# EAGLE schematic canSlaveV04 (EAGLE 6.5.0)

## Sheet 1 of 5
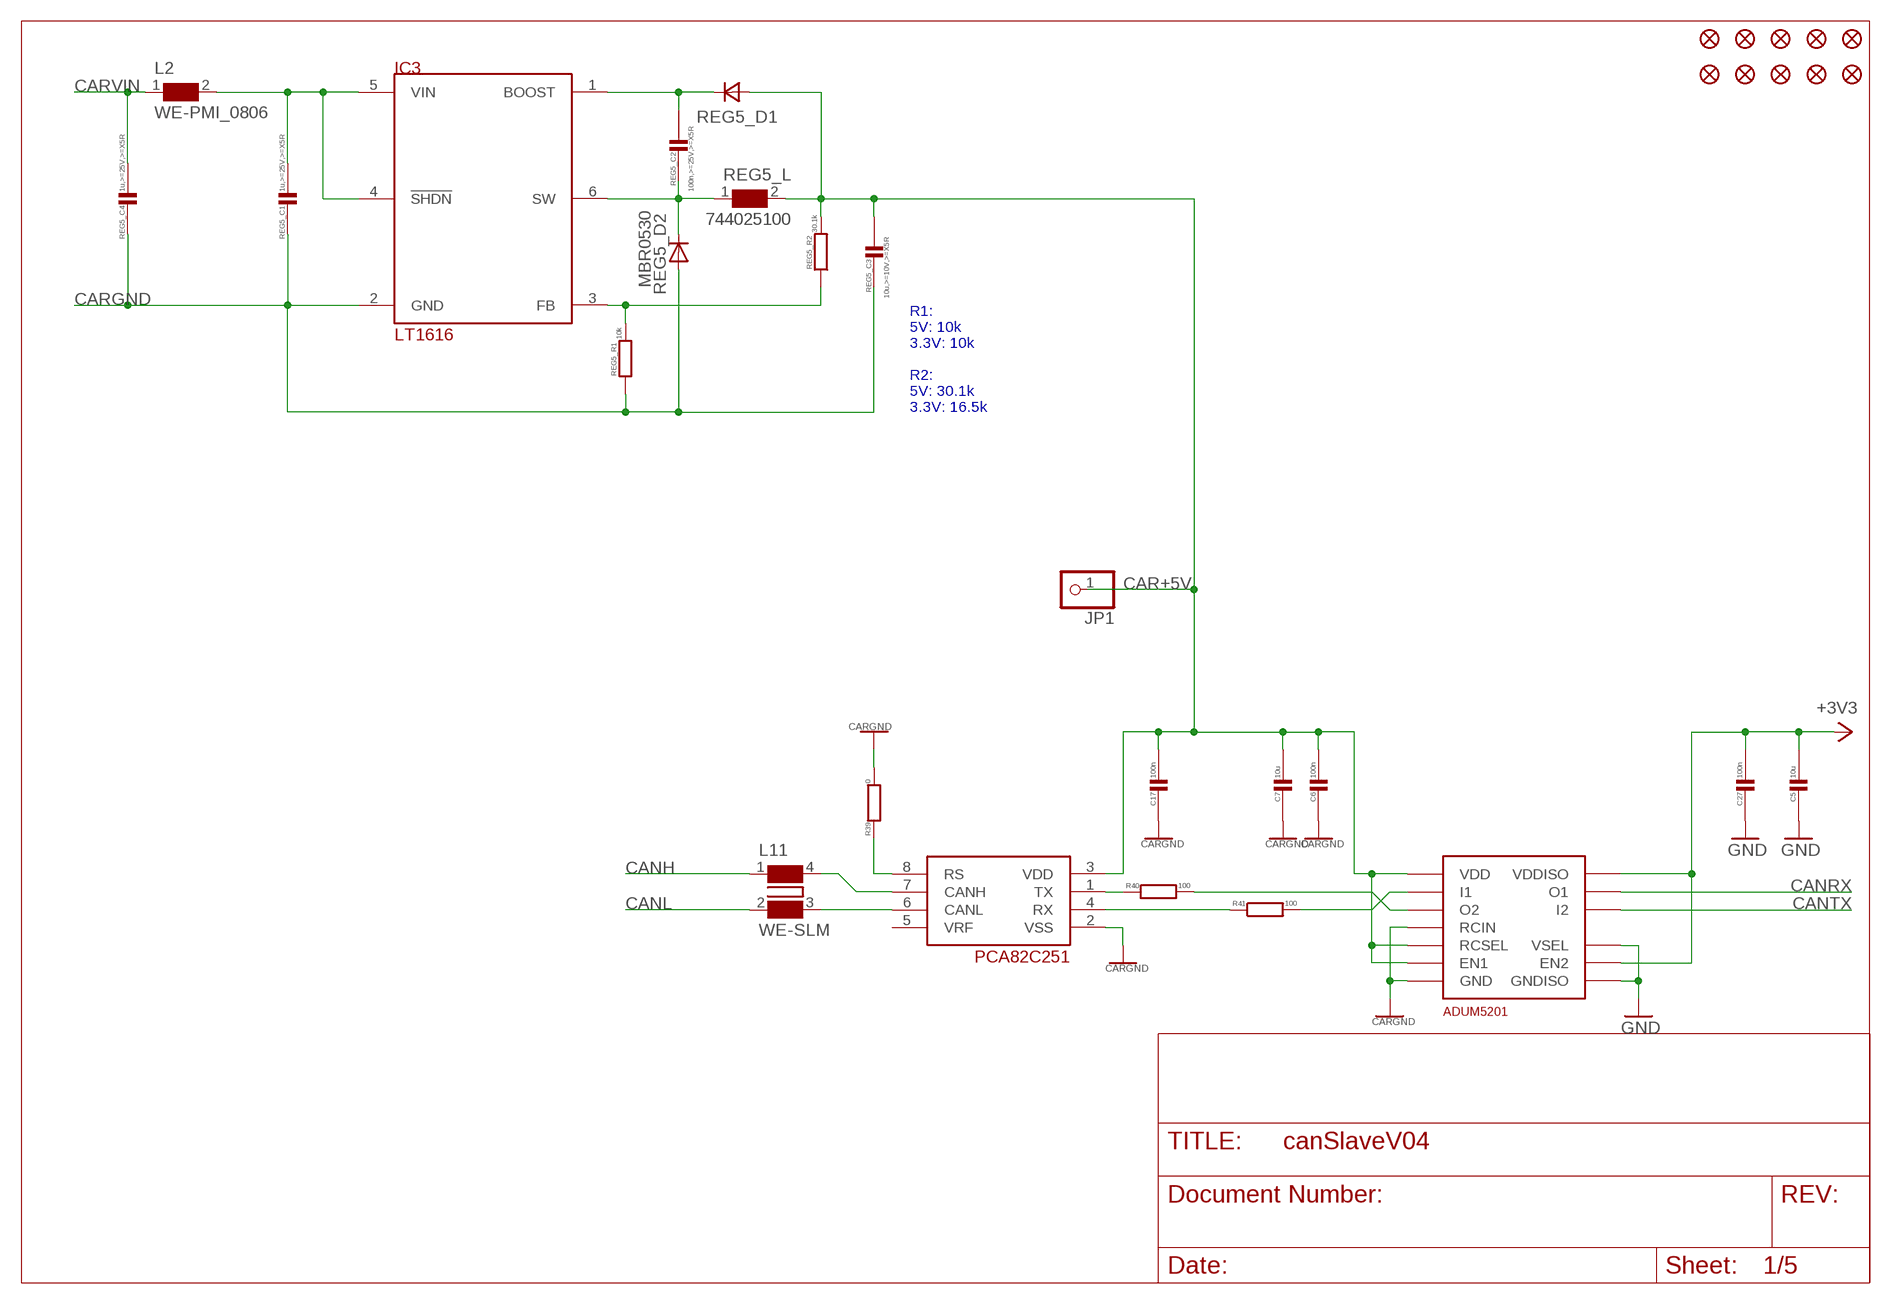
[diagram p0: schematic, sheet 1]

### Parts
C5  10u  C0603  [C0603]
C6  100n  C0402  [C0402]
C7  10u  C0603  [C0603]
C17  100n  C0402  [C0402]
C27  100n  C0402  [C0402]
FID1  FIDUCIAL""  [FIDUCIAL_1MM]
FID2  FIDUCIAL""  [FIDUCIAL_1MM]
FID3  FIDUCIAL""  [FIDUCIAL_1MM]
FID4  FIDUCIAL""  [FIDUCIAL_1MM]
FID5  FIDUCIAL""  [FIDUCIAL_1MM]
FID6  FIDUCIAL""  [FIDUCIAL_1MM]
FID7  FIDUCIAL""  [FIDUCIAL_1MM]
FID8  FIDUCIAL""  [FIDUCIAL_1MM]
FID9  FIDUCIAL""  [FIDUCIAL_1MM]
FID10  FIDUCIAL""  [FIDUCIAL_1MM]
IC3  LT1616  [SOT23-6]
IC5  PCA82C251  MCP2551  [SO-8]
JP1  PINHD-1X1  [1X01]
L2  WE-PMI_0806  [WE-PMI_0806]
L11  WE-SLM  [WE-SLM]
R39  0  R0402  [R0402]
R40  100  R0402  [R0402]
R41  100  R0402  [R0402]
REG5_C1  1u,>=25V,>=X5R  C0603  [C0603]
REG5_C2  100n,>=25V,>=X5R  C0402  [C0402]
REG5_C3  10u,>=10V,>=X5R  C0603  [C0603]
REG5_C4  1u,>=25V,>=X5R  C0603  [C0603]
REG5_D1  DSOD323  [SOD323]
REG5_D2  MBR0530  D-SOD123  [SOD123]
REG5_L  744025100  WE-TPC_2828  [WE-TPC_2828]
REG5_R1  10k  R0402  [R0402]
REG5_R2  30.1k  R0402  [R0402]
U$2  ADUM5201  [SO16WB]

### Nets
+3V3: C5.1 C27.1 U$2.P$10(EN2) U$2.P$16(VDDISO) ; also sheet 2,3,5
BOOST1: IC3.1(BOOST) REG5_C2.1 REG5_D1.1(C)
CANH: L11.1 ; also sheet 5
CANL: L11.2 ; also sheet 5
CANRX: U$2.P$14(O1) ; also sheet 2
CANTX: U$2.P$13(I2) ; also sheet 2
CAR+5V: C6.1 C7.1 C17.1 IC5.3(VDD) JP1.1 REG5_C3.1 REG5_D1.2(A) REG5_L.2 REG5_R2.2 U$2.P$1(VDD) U$2.P$6(RCSEL) U$2.P$7(EN1)
CAR_CANRX: R41.2 U$2.P$3(I1)
CAR_CANRX_T: IC5.4(RX) R41.1
CAR_CANTX: R40.2 U$2.P$4(O2)
CAR_CANTX_T: IC5.1(TX) R40.1
CARGND: C6.2 C7.2 C17.2 IC3.2(GND) IC5.2(VSS) R39.2 REG5_C1.2 REG5_C3.2 REG5_C4.2 REG5_D2.2(A) REG5_R1.1 U$2.P$2(GND) U$2.P$5(RCIN) U$2.P$8(GND) ; also sheet 5
CARVIN: L2.1 REG5_C4.1 ; also sheet 5
CARVINFILT: IC3.4(!SHDN) IC3.5(VIN) L2.2 REG5_C1.1
FB1: IC3.3(FB) REG5_R1.2 REG5_R2.1
GND: C5.2 C27.2 U$2.P$9(GNDISO) U$2.P$11(VSEL) U$2.P$15(GNDISO) ; also sheet 2,3,5
N$2: IC5.7(CANH) L11.4
N$6: IC5.6(CANL) L11.3
RS1: IC5.8(RS) R39.1
SW1: IC3.6(SW) REG5_C2.2 REG5_D2.1(C) REG5_L.1
Unconnected: IC5.5(VRF)

### Notes on the sheet
- R1:
  5V: 10k
  3.3V: 10k
  
  R2:
  5V: 30.1k
  3.3V: 16.5k

## Sheet 2 of 5
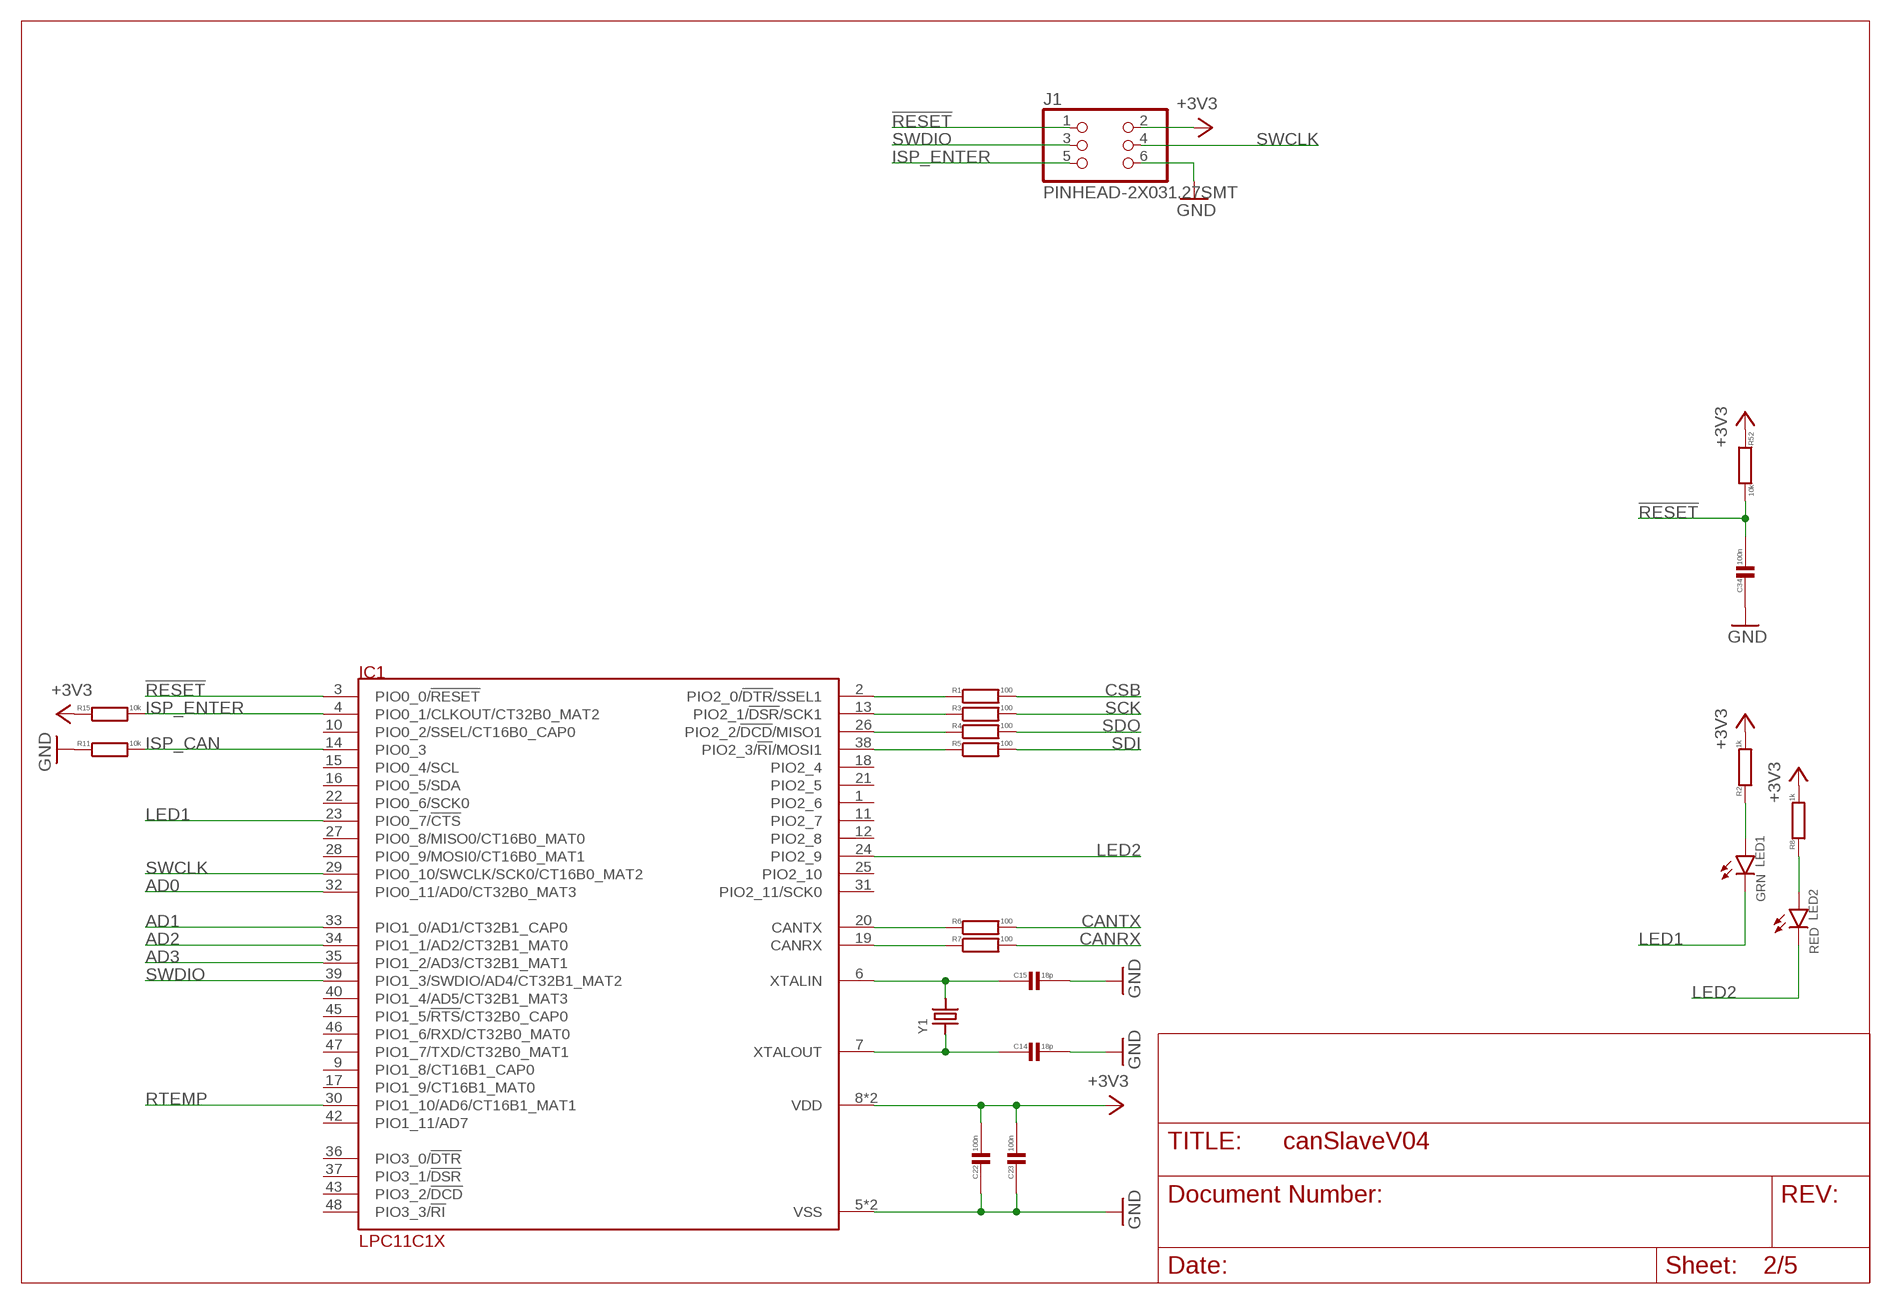
[diagram p1: schematic, sheet 2]

### Parts
C14  18p  C0402  [C0402]
C15  18p  C0402  [C0402]
C22  100n  C0402  [C0402]
C23  100n  C0402  [C0402]
C34  100n  C0402  [C0402]
IC1  LPC11C1X  [LQFP48]
J1  PINHEAD-2X031.27SMT  [2X03_1.27MM_SMT]
LED1  GRN  LED0402  [CHIPLED_0402]
LED2  RED  LED0402  [CHIPLED_0402]
R1  100  R0402  [R0402]
R2  1k  R0402  [R0402]
R3  100  R0402  [R0402]
R4  100  R0402  [R0402]
R5  100  R0402  [R0402]
R6  100  R0402  [R0402]
R7  100  R0402  [R0402]
R8  1k  R0402  [R0402]
R11  10k  R0402  [R0402]
R15  10k  R0402  [R0402]
R52  10k  R0402  [R0402]
Y1  CRYSTALTHIN  [CRYSTAL_3.2X2.5]

### Nets
!RESET: C34.1 IC1.3(PIO0_0/!RESET) J1.1 R52.2
+3V3: C22.1 C23.1 IC1.8(VDD) IC1.44(VDD) J1.2 R2.2 R8.2 R15.1 R52.1 ; also sheet 1,3,5
AD0: IC1.32(PIO0_11/AD0/CT32B0_MAT3) ; also sheet 5
AD1: IC1.33(PIO1_0/AD1/CT32B1_CAP0) ; also sheet 5
AD2: IC1.34(PIO1_1/AD2/CT32B1_MAT0) ; also sheet 5
AD3: IC1.35(PIO1_2/AD3/CT32B1_MAT1) ; also sheet 5
CANRX: R7.2 ; also sheet 1
CANRX_U_L: IC1.19(CANRX) R7.1
CANTX: R6.2 ; also sheet 1
CANTX_U_L: IC1.20(CANTX) R6.1
CSB: R1.2 ; also sheet 3
GND: C14.1 C15.1 C22.2 C23.2 C34.2 IC1.5(VSS) IC1.41(VSS) J1.6 R11.1 ; also sheet 1,3,5
ISP_CAN: IC1.14(PIO0_3) R11.2
ISP_ENTER: IC1.4(PIO0_1/CLKOUT/CT32B0_MAT2) J1.5 R15.2
LED1: IC1.23(PIO0_7/!CTS) LED1.C
LED2: IC1.24(PIO2_9) LED2.C
MISO: IC1.26(PIO2_2/!DCD!/MISO1) R4.1
MOSI: IC1.38(PIO2_3/!RI!/MOSI1) R5.1
N$1: LED2.A R8.1
N$5: LED1.A R2.1
RTEMP: IC1.30(PIO1_10/AD6/CT16B1_MAT1) ; also sheet 3
SCK: R3.2 ; also sheet 3
SCK1: IC1.13(PIO2_1/!DSR!/SCK1) R3.1
SDI: R5.2 ; also sheet 3
SDO: R4.2 ; also sheet 3
SSEL: IC1.2(PIO2_0/!DTR!/SSEL1) R1.1
SWCLK: IC1.29(PIO0_10/SWCLK/SCK0/CT16B0_MAT2) J1.4
SWDIO: IC1.39(PIO1_3/SWDIO/AD4/CT32B1_MAT2) J1.3
XTALIN: C15.2 IC1.6(XTALIN) Y1.2
XTALOUT: C14.2 IC1.7(XTALOUT) Y1.1
Unconnected: IC1.1(PIO2_6) IC1.9(PIO1_8/CT16B1_CAP0) IC1.10(PIO0_2/SSEL/CT16B0_CAP0) IC1.11(PIO2_7) IC1.12(PIO2_8) IC1.15(PIO0_4/SCL) IC1.16(PIO0_5/SDA) IC1.17(PIO1_9/CT16B1_MAT0) IC1.18(PIO2_4) IC1.21(PIO2_5) IC1.22(PIO0_6/SCK0) IC1.25(PIO2_10) IC1.27(PIO0_8/MISO0/CT16B0_MAT0) IC1.28(PIO0_9/MOSI0/CT16B0_MAT1) IC1.31(PIO2_11/SCK0) IC1.36(PIO3_0/!DTR) IC1.37(PIO3_1/!DSR) IC1.40(PIO1_4/AD5/CT32B1_MAT3) IC1.42(PIO1_11/AD7) IC1.43(PIO3_2/!DCD) IC1.45(PIO1_5/!RTS!/CT32B0_CAP0) IC1.46(PIO1_6/RXD/CT32B0_MAT0) IC1.47(PIO1_7/TXD/CT32B0_MAT1) IC1.48(PIO3_3/!RI)

## Sheet 3 of 5
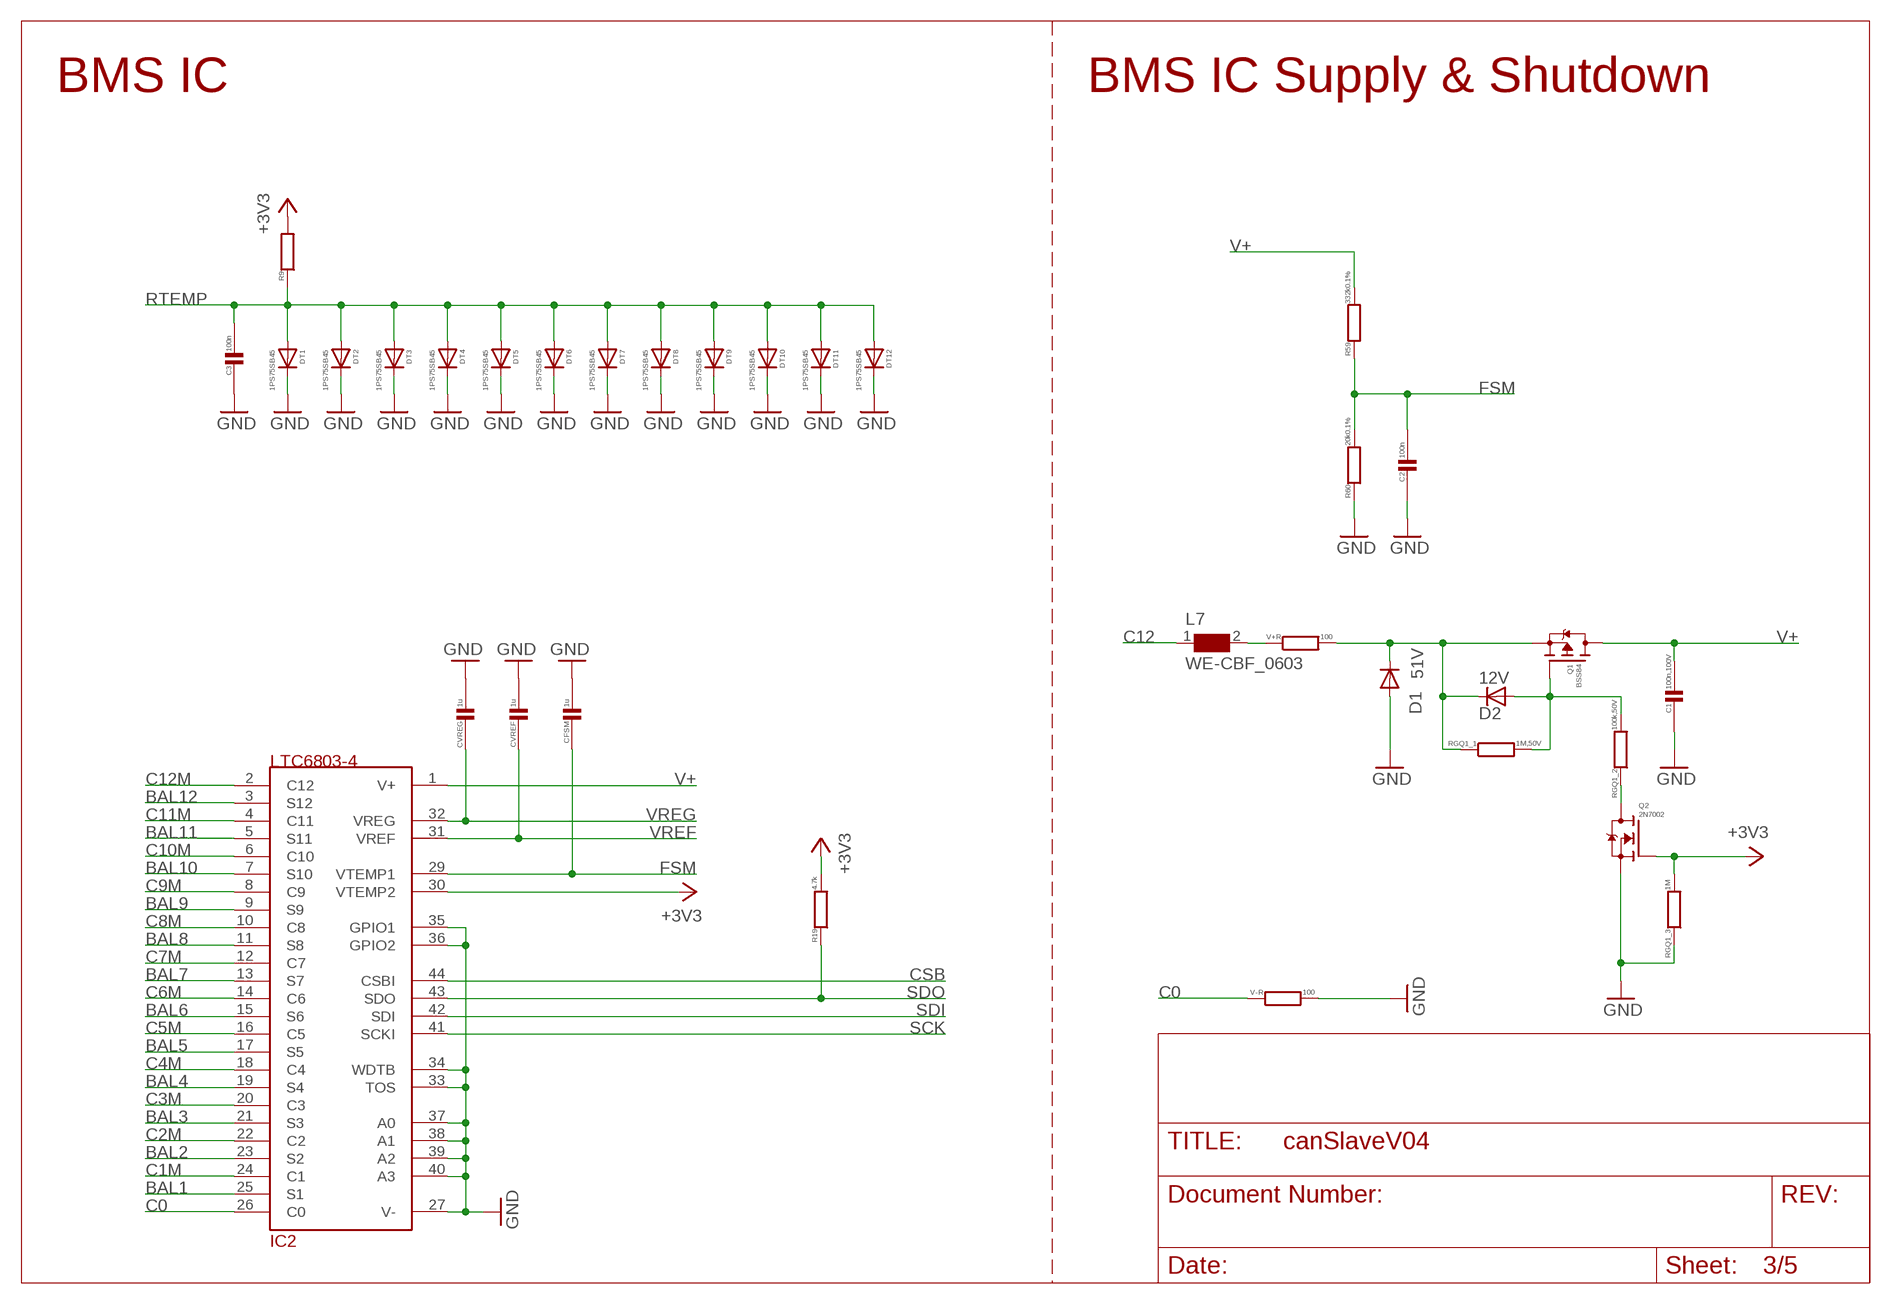
[diagram p2: schematic, sheet 3]

### Parts
C1  100n,100V  C0603  [C0603]
C2  100n  C0402  [C0402]
C3  100n  C0402  [C0402]
CFSM  1u  C0402  [C0402]
CVREF  1u  C0402  [C0402]
CVREG  1u  C0402  [C0402]
D1  51V  DIODE-SOD323-R  [SOD323-R]
D2  12V  DIODE-SOD323-R  [SOD323-R]
DT1  1PS75SB45  DIODE-SOT416  [SOT416]
DT2  1PS75SB45  DIODE-SOT416  [SOT416]
DT3  1PS75SB45  DIODE-SOT416  [SOT416]
DT4  1PS75SB45  DIODE-SOT416  [SOT416]
DT5  1PS75SB45  DIODE-SOT416  [SOT416]
DT6  1PS75SB45  DIODE-SOT416  [SOT416]
DT7  1PS75SB45  DIODE-SOT416  [SOT416]
DT8  1PS75SB45  DIODE-SOT416  [SOT416]
DT9  1PS75SB45  DIODE-SOT416  [SOT416]
DT10  1PS75SB45  DIODE-SOT416  [SOT416]
DT11  1PS75SB45  DIODE-SOT416  [SOT416]
DT12  1PS75SB45  DIODE-SOT416  [SOT416]
IC2  LTC6803-4  [44SSOP]
L7  WE-CBF_0603  [0603]
Q1  BSS84  [SOT23]
Q2  2N7002  [SOT23]
R9  R0603  [R0603]
R19  4.7k  R0402  [R0402]
R59  332k0.1%  R0603  [R0603]
R60  20k0.1%  R0402  [R0402]
RGQ1_1  1M,50V  R0603  [R0603]
RGQ1_2  100k,50V  R0603  [R0603]
RGQ1_3  1M  R0402  [R0402]
V+R  100  R0603  [R0603]
V-R  100  R0603  [R0603]

### Nets
+3V3: IC2.30(VTEMP2) Q2.1(G) R9.2 R19.2 RGQ1_3.2 ; also sheet 1,2,5
BAL1: IC2.25(S1) ; also sheet 4
BAL2: IC2.23(S2) ; also sheet 4
BAL3: IC2.21(S3) ; also sheet 4
BAL4: IC2.19(S4) ; also sheet 4
BAL5: IC2.17(S5) ; also sheet 4
BAL6: IC2.15(S6) ; also sheet 4
BAL7: IC2.13(S7) ; also sheet 4
BAL8: IC2.11(S8) ; also sheet 4
BAL9: IC2.9(S9) ; also sheet 4
BAL10: IC2.7(S10) ; also sheet 4
BAL11: IC2.5(S11) ; also sheet 4
BAL12: IC2.3(S12) ; also sheet 4
C0: IC2.26(C0) V-R.1 ; also sheet 4,5
C1M: IC2.24(C1) ; also sheet 4
C2M: IC2.22(C2) ; also sheet 4
C3M: IC2.20(C3) ; also sheet 4
C4M: IC2.18(C4) ; also sheet 4
C5M: IC2.16(C5) ; also sheet 4
C6M: IC2.14(C6) ; also sheet 4
C7M: IC2.12(C7) ; also sheet 4
C8M: IC2.10(C8) ; also sheet 4
C9M: IC2.8(C9) ; also sheet 4
C10M: IC2.6(C10) ; also sheet 4
C11M: IC2.4(C11) ; also sheet 4
C12: L7.1 ; also sheet 4,5
C12M: IC2.2(C12) ; also sheet 4
CSB: IC2.44(CSBI) ; also sheet 2
FSM: C2.1 CFSM.2 IC2.29(VTEMP1) R59.1 R60.2
GND: C1.2 C2.2 C3.2 CFSM.1 CVREF.1 CVREG.1 D1.A DT1.3(C) DT2.3(C) DT3.3(C) DT4.3(C) DT5.3(C) DT6.3(C) DT7.3(C) DT8.3(C) DT9.3(C) DT10.3(C) DT11.3(C) DT12.3(C) IC2.27(V-) IC2.33(TOS) IC2.34(WDTB) IC2.35(GPIO1) IC2.36(GPIO2) IC2.37(A0) IC2.38(A1) IC2.39(A2) IC2.40(A3) Q2.2(S) R60.1 RGQ1_3.1 V-R.2 ; also sheet 1,2,5
N$3: Q2.3(D) RGQ1_2.1
N$4: L7.2 V+R.1
Q1G: D2.A Q1.1(G) RGQ1_1.2 RGQ1_2.2
RTEMP: C3.1 DT1.1(A) DT2.1(A) DT3.1(A) DT4.1(A) DT5.1(A) DT6.1(A) DT7.1(A) DT8.1(A) DT9.1(A) DT10.1(A) DT11.1(A) DT12.1(A) R9.1 ; also sheet 2
SCK: IC2.41(SCKI) ; also sheet 2
SDI: IC2.42(SDI) ; also sheet 2
SDO: IC2.43(SDO) R19.1 ; also sheet 2
V+: C1.1 IC2.1(V+) Q1.3(D) R59.2
V+S: D1.C D2.C Q1.2(S) RGQ1_1.1 V+R.2
VREF: CVREF.2 IC2.31(VREF)
VREG: CVREG.2 IC2.32(VREG)

### Notes on the sheet
- BMS IC | BMS IC Supply & Shutdown

## Sheet 4 of 5
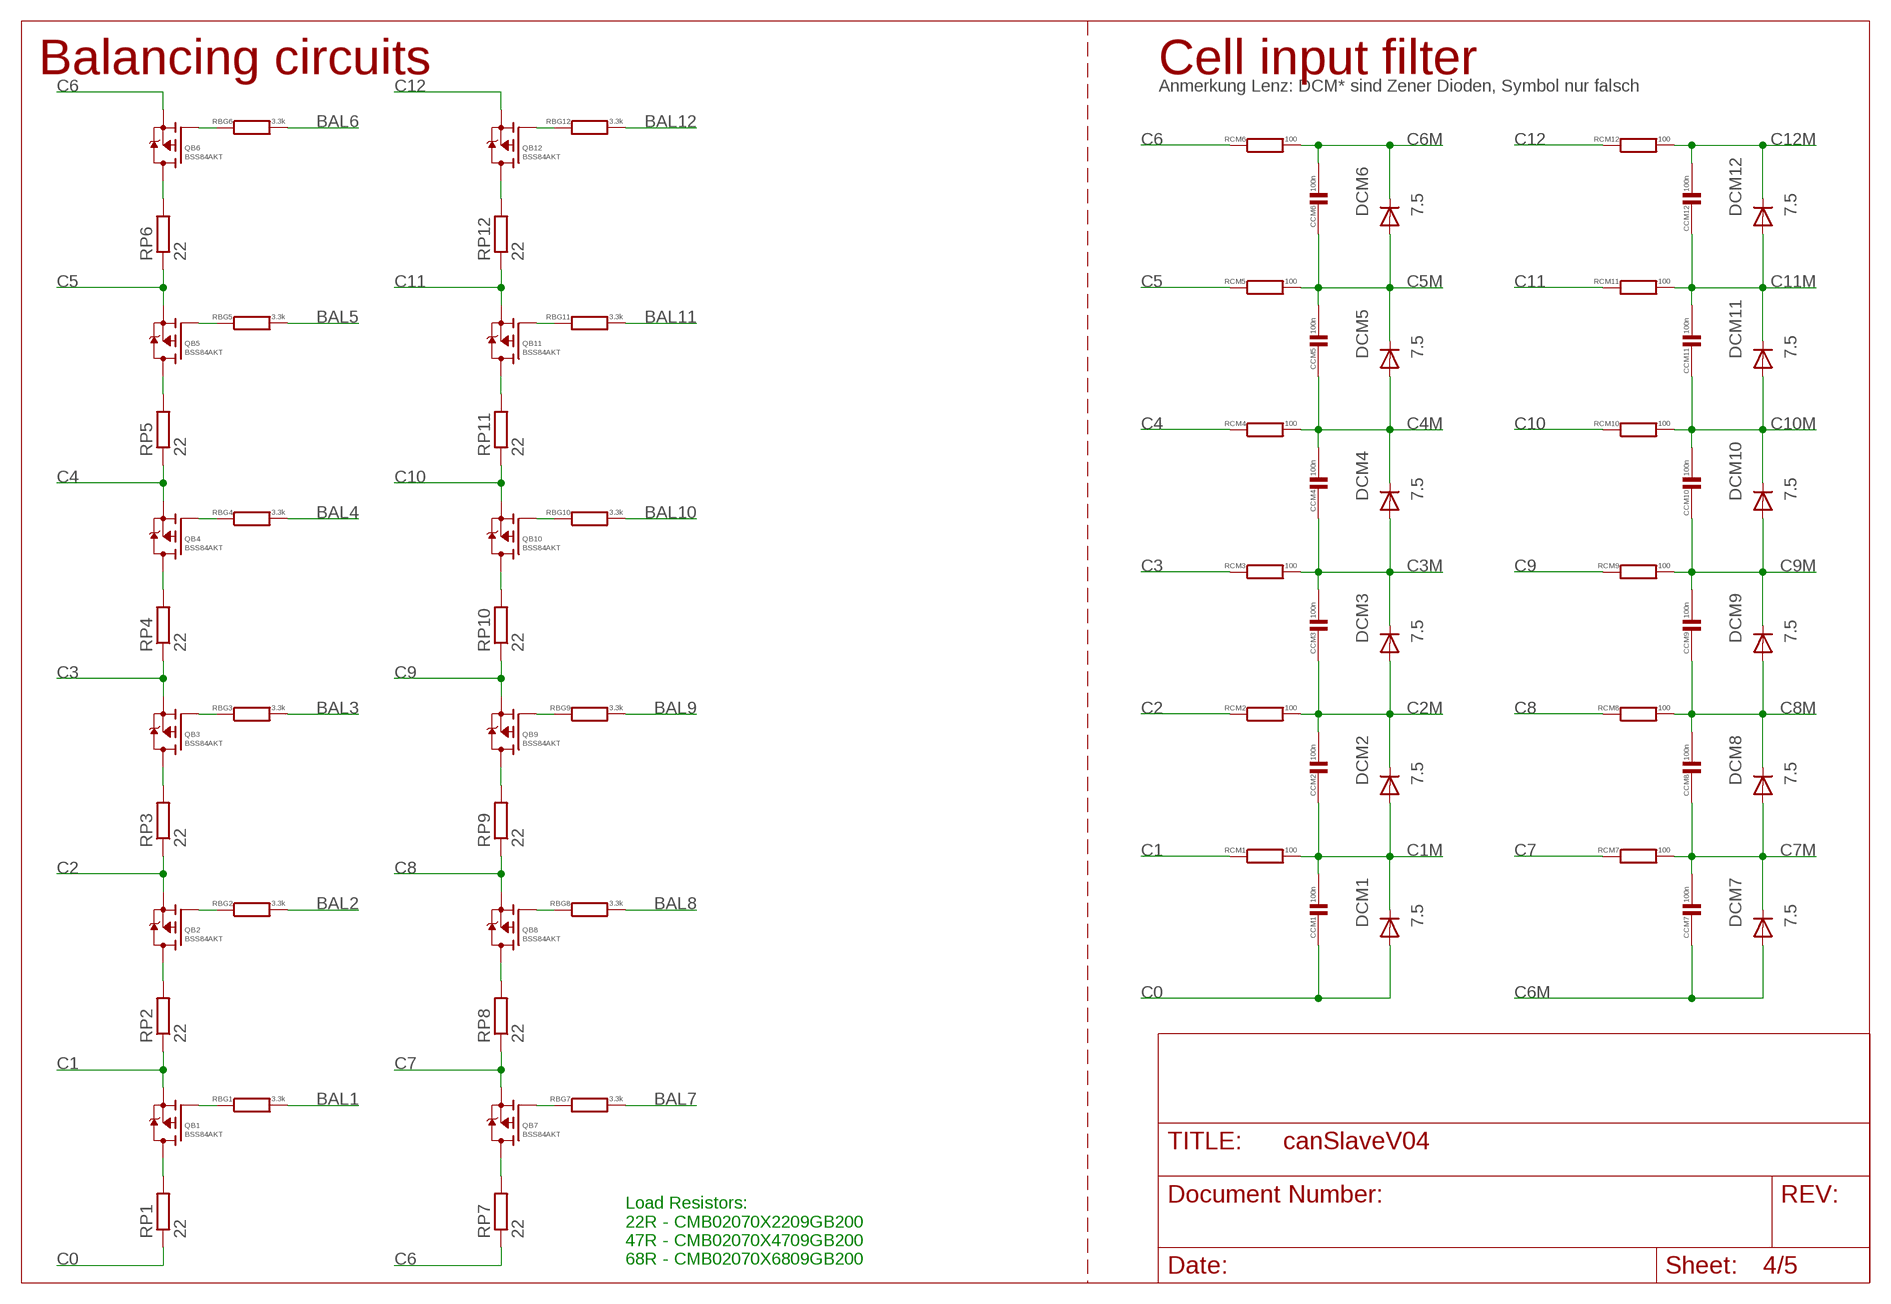
[diagram p3: schematic, sheet 4]

### Parts
CCM1  100n  C0402  [C0402]
CCM2  100n  C0402  [C0402]
CCM3  100n  C0402  [C0402]
CCM4  100n  C0402  [C0402]
CCM5  100n  C0402  [C0402]
CCM6  100n  C0402  [C0402]
CCM7  100n  C0402  [C0402]
CCM8  100n  C0402  [C0402]
CCM9  100n  C0402  [C0402]
CCM10  100n  C0402  [C0402]
CCM11  100n  C0402  [C0402]
CCM12  100n  C0402  [C0402]
DCM1  7.5  DIODE-SOD323-L  [SOD323-L]
DCM2  7.5  DIODE-SOD323-L  [SOD323-L]
DCM3  7.5  DIODE-SOD323-L  [SOD323-L]
DCM4  7.5  DIODE-SOD323-L  [SOD323-L]
DCM5  7.5  DIODE-SOD323-L  [SOD323-L]
DCM6  7.5  DIODE-SOD323-L  [SOD323-L]
DCM7  7.5  DIODE-SOD323-L  [SOD323-L]
DCM8  7.5  DIODE-SOD323-L  [SOD323-L]
DCM9  7.5  DIODE-SOD323-L  [SOD323-L]
DCM10  7.5  DIODE-SOD323-L  [SOD323-L]
DCM11  7.5  DIODE-SOD323-L  [SOD323-L]
DCM12  7.5  DIODE-SOD323-L  [SOD323-L]
QB1  BSS84AKT  [SOT416]
QB2  BSS84AKT  [SOT416]
QB3  BSS84AKT  [SOT416]
QB4  BSS84AKT  [SOT416]
QB5  BSS84AKT  [SOT416]
QB6  BSS84AKT  [SOT416]
QB7  BSS84AKT  [SOT416]
QB8  BSS84AKT  [SOT416]
QB9  BSS84AKT  [SOT416]
QB10  BSS84AKT  [SOT416]
QB11  BSS84AKT  [SOT416]
QB12  BSS84AKT  [SOT416]
RBG1  3.3k  R0402  [R0402]
RBG2  3.3k  R0402  [R0402]
RBG3  3.3k  R0402  [R0402]
RBG4  3.3k  R0402  [R0402]
RBG5  3.3k  R0402  [R0402]
RBG6  3.3k  R0402  [R0402]
RBG7  3.3k  R0402  [R0402]
RBG8  3.3k  R0402  [R0402]
RBG9  3.3k  R0402  [R0402]
RBG10  3.3k  R0402  [R0402]
RBG11  3.3k  R0402  [R0402]
RBG12  3.3k  R0402  [R0402]
RCM1  100  R0402  [R0402]
RCM2  100  R0402  [R0402]
RCM3  100  R0402  [R0402]
RCM4  100  R0402  [R0402]
RCM5  100  R0402  [R0402]
RCM6  100  R0402  [R0402]
RCM7  100  R0402  [R0402]
RCM8  100  R0402  [R0402]
RCM9  100  R0402  [R0402]
RCM10  100  R0402  [R0402]
RCM11  100  R0402  [R0402]
RCM12  100  R0402  [R0402]
RP1  22  R-EU_MELF0207R  [MINI_MELF-0207R]
RP2  22  R-EU_MELF0207R  [MINI_MELF-0207R]
RP3  22  R-EU_MELF0207R  [MINI_MELF-0207R]
RP4  22  R-EU_MELF0207R  [MINI_MELF-0207R]
RP5  22  R-EU_MELF0207R  [MINI_MELF-0207R]
RP6  22  R-EU_MELF0207R  [MINI_MELF-0207R]
RP7  22  R-EU_MELF0207R  [MINI_MELF-0207R]
RP8  22  R-EU_MELF0207R  [MINI_MELF-0207R]
RP9  22  R-EU_MELF0207R  [MINI_MELF-0207R]
RP10  22  R-EU_MELF0207R  [MINI_MELF-0207R]
RP11  22  R-EU_MELF0207R  [MINI_MELF-0207R]
RP12  22  R-EU_MELF0207R  [MINI_MELF-0207R]

### Nets
BAL1: RBG1.2 ; also sheet 3
BAL2: RBG2.2 ; also sheet 3
BAL3: RBG3.2 ; also sheet 3
BAL4: RBG4.2 ; also sheet 3
BAL5: RBG5.2 ; also sheet 3
BAL6: RBG6.2 ; also sheet 3
BAL7: RBG7.2 ; also sheet 3
BAL8: RBG8.2 ; also sheet 3
BAL9: RBG9.2 ; also sheet 3
BAL10: RBG10.2 ; also sheet 3
BAL11: RBG11.2 ; also sheet 3
BAL12: RBG12.2 ; also sheet 3
C0: CCM1.2 DCM1.A RP1.1 ; also sheet 3,5
C1: QB1.2(S) RCM1.1 RP2.1 ; also sheet 5
C1M: CCM1.1 CCM2.2 DCM1.C DCM2.A RCM1.2 ; also sheet 3
C2: QB2.2(S) RCM2.1 RP3.1 ; also sheet 5
C2M: CCM2.1 CCM3.2 DCM2.C DCM3.A RCM2.2 ; also sheet 3
C3: QB3.2(S) RCM3.1 RP4.1 ; also sheet 5
C3M: CCM3.1 CCM4.2 DCM3.C DCM4.A RCM3.2 ; also sheet 3
C4: QB4.2(S) RCM4.1 RP5.1 ; also sheet 5
C4M: CCM4.1 CCM5.2 DCM4.C DCM5.A RCM4.2 ; also sheet 3
C5: QB5.2(S) RCM5.1 RP6.1 ; also sheet 5
C5M: CCM5.1 CCM6.2 DCM5.C DCM6.A RCM5.2 ; also sheet 3
C6: QB6.2(S) RCM6.1 RP7.1 ; also sheet 5
C6M: CCM6.1 CCM7.2 DCM6.C DCM7.A RCM6.2 ; also sheet 3
C7: QB7.2(S) RCM7.1 RP8.1 ; also sheet 5
C7M: CCM7.1 CCM8.2 DCM7.C DCM8.A RCM7.2 ; also sheet 3
C8: QB8.2(S) RCM8.1 RP9.1 ; also sheet 5
C8M: CCM8.1 CCM9.2 DCM8.C DCM9.A RCM8.2 ; also sheet 3
C9: QB9.2(S) RCM9.1 RP10.1 ; also sheet 5
C9M: CCM9.1 CCM10.2 DCM9.C DCM10.A RCM9.2 ; also sheet 3
C10: QB10.2(S) RCM10.1 RP11.1 ; also sheet 5
C10M: CCM10.1 CCM11.2 DCM10.C DCM11.A RCM10.2 ; also sheet 3
C11: QB11.2(S) RCM11.1 RP12.1 ; also sheet 5
C11M: CCM11.1 CCM12.2 DCM11.C DCM12.A RCM11.2 ; also sheet 3
C12: QB12.2(S) RCM12.1 ; also sheet 3,5
C12M: CCM12.1 DCM12.C RCM12.2 ; also sheet 3
CR1: QB1.3(D) RP1.2
CR2: QB2.3(D) RP2.2
CR3: QB3.3(D) RP3.2
CR4: QB4.3(D) RP4.2
CR5: QB5.3(D) RP5.2
CR6: QB6.3(D) RP6.2
CR7: QB7.3(D) RP7.2
CR8: QB8.3(D) RP8.2
CR9: QB9.3(D) RP9.2
CR10: QB10.3(D) RP10.2
CR11: QB11.3(D) RP11.2
CR12: QB12.3(D) RP12.2
QBG1: QB1.1(G) RBG1.1
QBG2: QB2.1(G) RBG2.1
QBG3: QB3.1(G) RBG3.1
QBG4: QB4.1(G) RBG4.1
QBG5: QB5.1(G) RBG5.1
QBG6: QB6.1(G) RBG6.1
QBG7: QB7.1(G) RBG7.1
QBG8: QB8.1(G) RBG8.1
QBG9: QB9.1(G) RBG9.1
QBG10: QB10.1(G) RBG10.1
QBG11: QB11.1(G) RBG11.1
QBG12: QB12.1(G) RBG12.1

### Notes on the sheet
- Balancing circuits | Cell input filter
- Anmerkung Lenz: DCM* sind Zener Dioden, Symbol nur falsch
- Load Resistors:
  22R - CMB02070X2209GB200 
  47R - CMB02070X4709GB200 
  68R - CMB02070X6809GB200

## Sheet 5 of 5
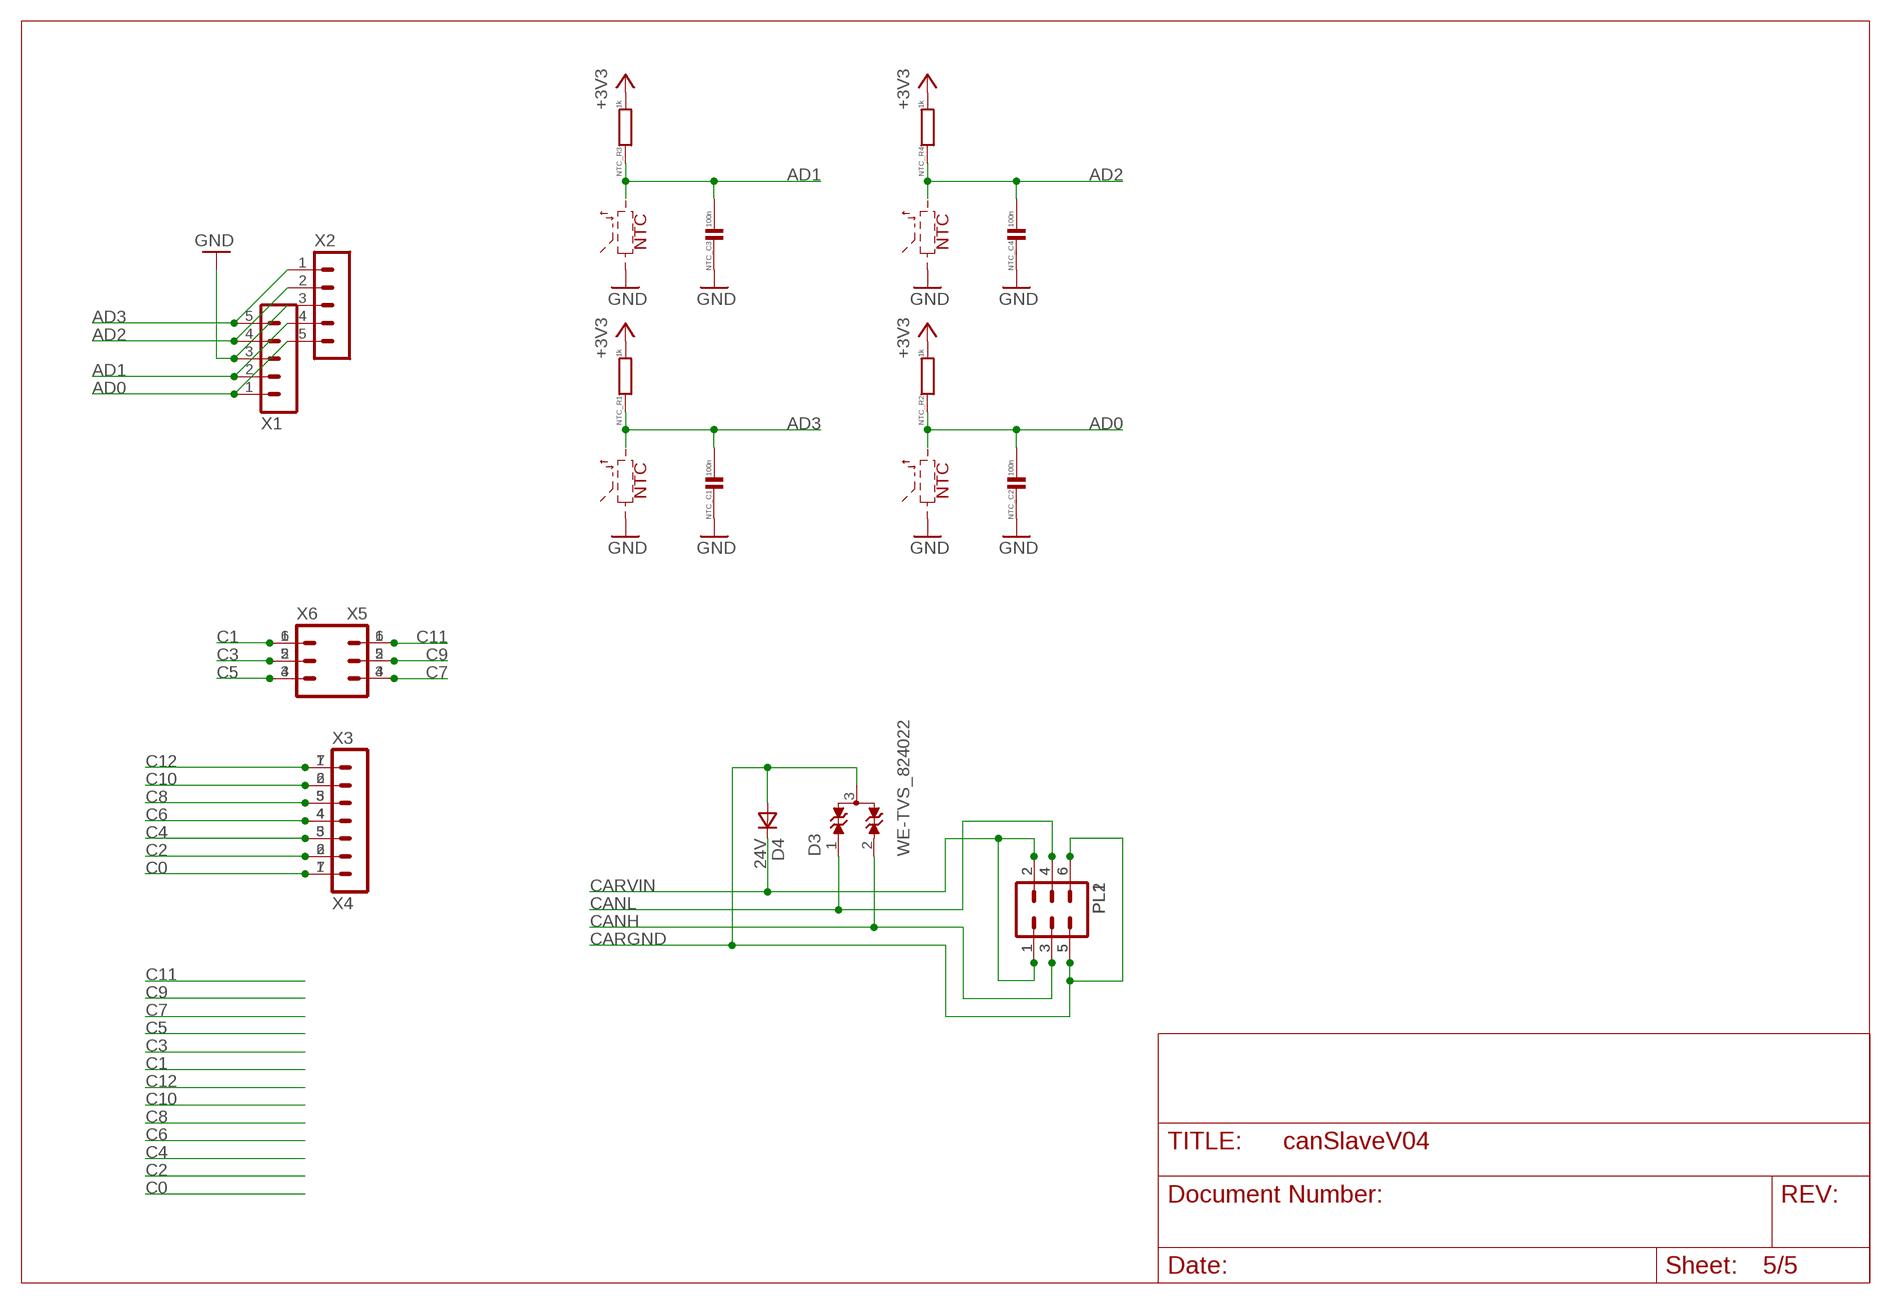
[diagram p4: schematic, sheet 5]

### Parts
D3  WE-TVS_824022  [WE-TVS_SOT23-3L]
D4  24V  DSOD323  [SOD323]
NTC_C1  100n  C0402  [C0402]
NTC_C2  100n  C0402  [C0402]
NTC_C3  100n  C0402  [C0402]
NTC_C4  100n  C0402  [C0402]
NTC_R1  1k  R0402  [R0402]
NTC_R2  1k  R0402  [R0402]
NTC_R3  1k  R0402  [R0402]
NTC_R4  1k  R0402  [R0402]
PL1  06V  [06V]
PL2  06H  [06H]
X1  HEADER_POS5_43650-0500  [43650-0500]
X2  HEADER_POS5_43650-0515  [43650-0515]
X3  HEADER_POS7_43650-0700  [43650-0700]
X4  HEADER_POS7_43650-0715  [43650-0715]
X5  HEADER_POS6_43650-0615  [43650-0615]
X6  HEADER_POS6_43650-0600  [43650-0600]

### Nets
+3V3: NTC_R1.2 NTC_R2.2 NTC_R3.2 NTC_R4.2 ; also sheet 1,2,3
AD0: NTC_C2.1 NTC_R2.1 X1.1 X2.5 ; also sheet 2
AD1: NTC_C3.1 NTC_R3.1 X1.2 X2.4 ; also sheet 2
AD2: NTC_C4.1 NTC_R4.1 X1.4 X2.2 ; also sheet 2
AD3: NTC_C1.1 NTC_R1.1 X1.5 X2.1 ; also sheet 2
C0: X3.7 X4.1 ; also sheet 3,4
C1: X5.6 X6.1 ; also sheet 4
C2: X3.6 X4.2 ; also sheet 4
C3: X5.5 X6.2 ; also sheet 4
C4: X3.5 X4.3 ; also sheet 4
C5: X5.4 X6.3 ; also sheet 4
C6: X3.4 X4.4 ; also sheet 4
C7: X5.3 X6.4 ; also sheet 4
C8: X3.3 X4.5 ; also sheet 4
C9: X5.2 X6.5 ; also sheet 4
C10: X3.2 X4.6 ; also sheet 4
C11: X5.1 X6.6 ; also sheet 4
C12: X3.1 X4.7 ; also sheet 3,4
CANH: D3.2 PL1.3 PL2.3 ; also sheet 1
CANL: D3.1 PL1.4 PL2.4 ; also sheet 1
CARGND: D3.3(GND) D4.2(A) PL1.5 PL1.6 PL2.5 PL2.6 ; also sheet 1
CARVIN: D4.1(C) PL1.1 PL1.2 PL2.1 PL2.2 ; also sheet 1
GND: NTC_C1.2 NTC_C2.2 NTC_C3.2 NTC_C4.2 X1.3 X2.3 ; also sheet 1,2,3

### Notes on the sheet
- NTC | NTC
- NTC | NTC

## Library data of the parts
C1-C3 C5-C7 C14 C15 C17 C22 C23 C27 C34 CCM1-CCM12 CFSM CVREF CVREG NTC_C1-NTC_C4 REG5_C1-REG5_C4 = phrenetic:C
D1 D2 = diode:DIODE-: DIODE
D3 = EagleLibrary_Wuerth_Elektronik_eiSos_Version_6:WE-TVS_824022: TVS Diode Array WE-TVS, Standard Series - Low capazity - No leakage current - Low clamping voltage - high ESD voltage protection - Uni- and bidirectional protection -- DC Distribution -- Headsets and Accessoires -- PDAs -- Digital Cameras -- MP3-Players -- Touch Panels
D4 REG5_D1 = zetex:D: DIODE; MPN: CDSOD323-T05C; OC_FARNELL: 1824860; OC_NEWARK: 79R6078
DCM1-DCM12 DT1-DT12 = phrenetic:DIODE-: DIODE
FID1-FID10 = microbuilder:FIDUCIAL: Fiducial Alignment Points Various fiducial points for machine vision alignment.
IC1 = phrenetic:LPC11C1X
IC2 = bms-hsrm:LTC6803-4
IC3 = phrenetic:LT1616
IC5 = bms-hsrm:MCP2551
J1 = phrenetic:PINHEAD-2X03
JP1 = pinhead:PINHD-1X1: PIN HEADER
L2 = EagleLibrary_Wuerth_Elektronik_eiSos_Version_6:WE-PMI: Power Multilayer Inductor WE-PMI - Compact multilayer type - Suitable for applocations with high currents up to 2.5 A - No crosstalk -- DC / DC converters especially at high switching frequencies -- Portable devices like PDA and digital cameras
L7 = EagleLibrary_Wuerth_Elektronik_eiSos_Version_6:WE-CBF: SMD EMI Suppression Ferrite Beads WE-CBF - Excellent anti-EMI properties - Low DC-restistance - Impedances till 3000 ohms - Rated current up to 6 A -- Reliable Ni-Sn electrodes -- Perfect as data lined filter and for uncoupling of distribution voltage
L11 = EagleLibrary_Wuerth_Elektronik_eiSos_Version_6:WE-SLM: SMD Common Mode Line Filter WE-SLM - Small size - Low Profile - High Impedance - High current capability up to 300 mA -- USB -- CAN -- Firewire -- Data Lines -- Power supply systems -- Signal Lines
LED1 LED2 = phrenetic:LED
NTC_R1-NTC_R4 R1-R9 R11 R15 R19 R39-R41 R52 R59 R60 RBG1-RBG12 RCM1-RCM12 REG5_R1 REG5_R2 RGQ1_1-RGQ1_3 V+R V-R = phrenetic:R: RESISTOR, Bla
PL1 = con-harting-v:06V: CONNECTOR; OC_FARNELL: unknown; OC_NEWARK: unknown
PL2 = con-harting-h:06H: CONNECTOR; OC_FARNELL: unknown; OC_NEWARK: unknown
Q1 QB1-QB12 = phrenetic:BSS84
Q2 = phrenetic:2N7002
REG5_D2 = semicon-smd-ipc:D-: DIODE unfilled
REG5_L = EagleLibrary_Wuerth_Elektronik_eiSos_Version_6:WE-TPC: Shielded Tiny Power Inductor WE-TPC - Extremely flat power inductor - High current capability - High reliability and perfect soldering characteristics because of integrated soldering pad - magnetically shielded -- Portable power like PDA, digital camera, PCMICA-cards and displays -- DC/DC-converter -- Recommended for switching regulator IC's from Linear Technology, National Semiconductor, Texas Instruments and Fairchild Semiconductor
RP1-RP12 = bms-hsrm:R-EU_: RESISTOR, European symbol
U$2 = phrenetic:ADUM5201
X1 X2 = con-molex-micro-fit-3_0:HEADER_POS5_?: Molex - Micro-Fit 3.0 Series connector, 3.00mm (0.118") pitch header, 5 positions.
X3 X4 = con-molex-micro-fit-3_0:HEADER_POS7_?: Molex - Micro-Fit 3.0 Series connector, 3.00mm (0.118") pitch header, 7 positions.
X5 X6 = con-molex-micro-fit-3_0:HEADER_POS6_?: Molex - Micro-Fit 3.0 Series connector, 3.00mm (0.118") pitch header, 6 positions.
Y1 = microbuilder:CRYSTAL: Crystals HC49UP - Surface Mount Crystal 4.0MHz 18pF +/-30ppm Surface Mount Crystal [Digikey: 535-9857-1-ND] 12.0 MHz Surface Mount Crystal [Digikey: 535-9869-6-ND] 25.0 MHz Surface Mount Crystal [Digikey: 535-9078-1-ND] 2.5 x 2.0mm - MEMs SMT Crystal 16.0 MHz 10pF 20ppm 2.5 x 2.0mm Crystal [Digikey -40-85°C: 535-10923-1-ND] 3.2 x 2.5mm - MEMs SMT Crystal 12.0 MHz 8pF 15ppm 3.2 x 2.5mm Crystal [Digikey: -10-70°C: 644-1047-1-ND -40-125°C: 644-1128-1-ND] 16.0 MHz 8pF 15ppm 3.2 x 2.5mm Crystal [Digikey: -10-70°C: 644-1049-1-ND -40-125°C: 644-1129-2-ND] 16.0 MHz 10pF 10ppm 3.2 x 2.5mm Crystal [Digikey: 644-1100-1-ND] 27.12 MHz 18pF 30ppm 3.2 x 2.5mm Crystal [Digikey: 887-1424-1-ND] 27.12MHz 10pF 10ppm 3.2 x 2.5mm Crystal [Digikey: 887-1329-1-ND] 4.9 x 1.8mm - MEMs SMT Crystal 32.768 KHz 12.5pF 20ppm 4.9 x 1.8mm Crystal [Digikey: SE2415CT-ND] 8.0 x 3.8mm - Surface Mount Crystal 32.768kHz 12.5pF 20ppm -40°C-85°C [Digikey: 535-9166-2-ND] Cylinder 32.768KHz Cylinder Crystal (2x6mm body) [Ex. Digikey: 300-8341-2-ND]